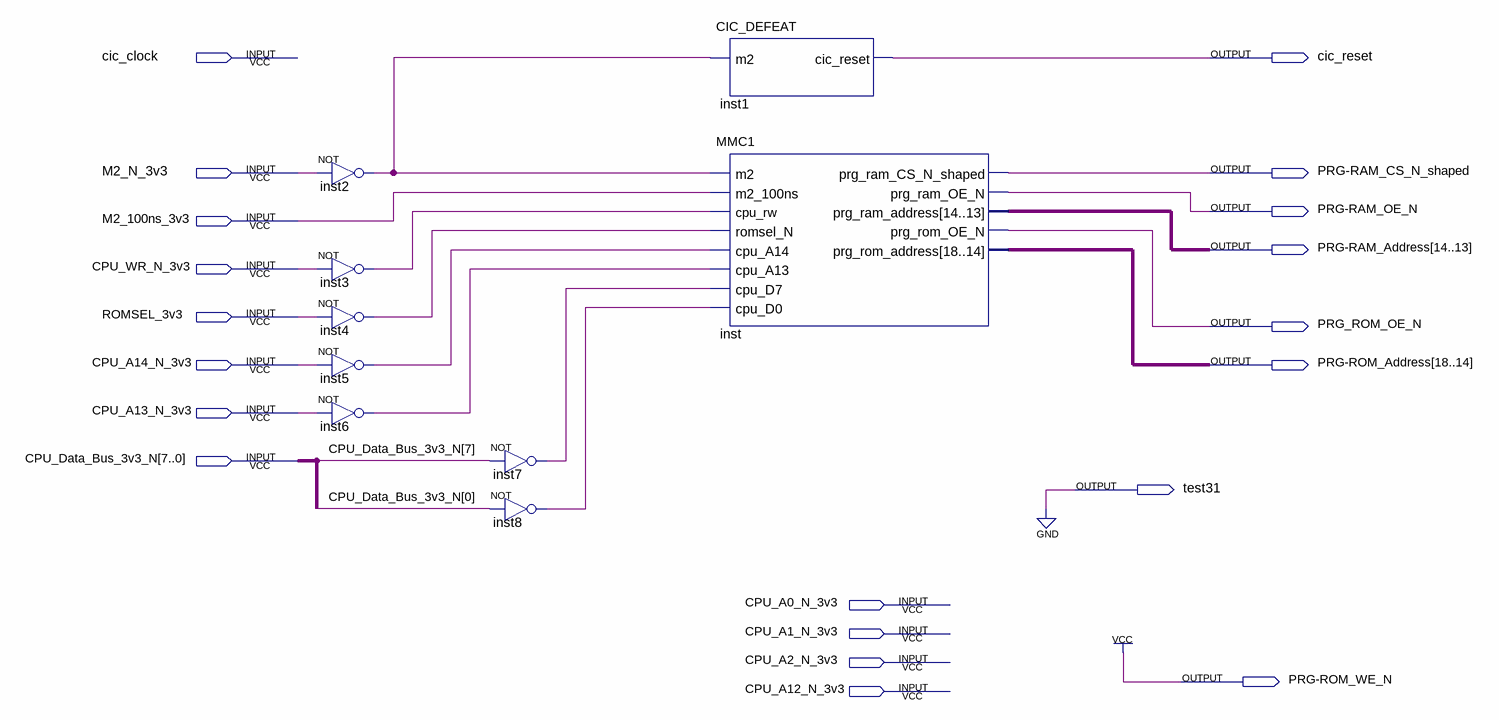
[diagram p0: schematic sheet]
// Quartus schematic boldt-mmc1.bdf as structural Verilog: 9 symbols, 20 pins
module \boldt-mmc1  (
  input  cic_clock,
  input  M2_N_3v3,
  input  M2_100ns_3v3,
  input  CPU_WR_N_3v3,
  input  ROMSEL_3v3,
  input  CPU_A14_N_3v3,
  input  CPU_A13_N_3v3,
  input  [7:0] CPU_Data_Bus_3v3_N,
  input  CPU_A0_N_3v3,
  input  CPU_A1_N_3v3,
  input  CPU_A2_N_3v3,
  input  CPU_A12_N_3v3,
  output cic_reset,
  output \PRG-RAM_CS_N_shaped ,
  output \PRG-RAM_OE_N ,
  output [14:13] \PRG-RAM_Address ,
  output PRG_ROM_OE_N,
  output [18:14] \PRG-ROM_Address ,
  output test31,
  output \PRG-ROM_WE_N 
);

  wire inst2_out, inst3_out, inst4_out, inst5_out, inst6_out, inst7_out, inst8_out;

  not inst2 (inst2_out, M2_N_3v3);
  not inst3 (inst3_out, CPU_WR_N_3v3);
  not inst4 (inst4_out, ROMSEL_3v3);
  not inst5 (inst5_out, CPU_A14_N_3v3);
  not inst6 (inst6_out, CPU_A13_N_3v3);
  not inst7 (inst7_out, CPU_Data_Bus_3v3_N[7]);
  not inst8 (inst8_out, CPU_Data_Bus_3v3_N[0]);
  CIC_DEFEAT inst1 (.m2(inst2_out), .cic_reset(cic_reset));
  MMC1 inst (
    .m2(inst2_out), .m2_100ns(M2_100ns_3v3), .cpu_rw(inst3_out), .romsel_N(inst4_out), .cpu_A14(inst5_out),
    .cpu_A13(inst6_out), .cpu_D7(inst7_out), .cpu_D0(inst8_out), .prg_ram_CS_N_shaped(\PRG-RAM_CS_N_shaped ),
    .prg_ram_OE_N(\PRG-RAM_OE_N ), .prg_ram_address(\PRG-RAM_Address ), .prg_rom_OE_N(PRG_ROM_OE_N),
    .prg_rom_address(\PRG-ROM_Address ));

  assign \PRG-ROM_WE_N  = 1'b1;
  assign test31 = 1'b0;
endmodule
